# Altium schematic sheet Schema.SchDoc
size A4
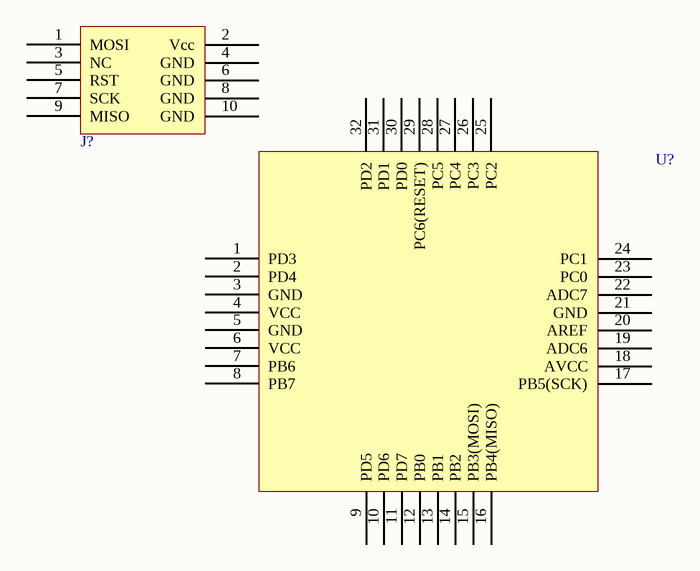
[diagram p0: Schema.SchDoc]

## Parts
J?  61201021721  [Male_10Pin]  (value not drawn)
U?  ATMEGA328P-MU  [QFN50P500X500X100_HS-33N]  (value not drawn)

## Nets

Not connected (* = marked no-connect by the designer): J? 1(MOSI) 2(Vcc) 3(NC) 4 (GND) 5(RST) 6(GND) 7(SCK) 8(GND) 9(MISO) 10(GND); U? 1(PD3) 2(PD4) 3(GND) 4(VCC) 5(GND) 6(VCC) 7(PB6) 8(PB7) 9(PD5) 10(PD6) 11(PD7) 12(PB0) 13(PB1) 14(PB2) 15(PB3(MOSI)) 16(PB4(MISO)) 17(PB5(SCK)) 18(AVCC) 19(ADC6) 20(AREF) 21(GND) 22(ADC7) 23(PC0) 24(PC1) 25(PC2) 26(PC3) 27(PC4) 28(PC5) 29(PC6(RESET)) 30(PD0) 31(PD1) 32(PD2)

## Library data of the parts
J? = 61201021721: CONN HEADER R/A 10POS 2.54MM; Manufacturer: Wurth Electronics; Current Rating: 3A; Voltage Rating: 250V; Number of Positions: 10; Insulation Resistance: 1GR; Gender: Male; Connector Type: Male Pin; Insulation: Insulated; Row Spacing: 0.1inch; Supplier 1: Digi-Key; Manufacturer Part Number: 61201021721; RoHS: Yes; Category: Headers and Wire Housings; Stock 1: 2053; Pricing 1: 1=0,59000, 10=0,58200, 50=0,53800, 100=0,48200, 260=0,43738 (USD); Mount: Through Hole; Contact Plating: Gold; Housing Material: PBT; Contact Material: Copper Alloy,Copper; Color: Black; Min Operating Temperature: -40°C; Max Operating Temperature: 125°C; Number of Rows: 2; Contact Gender: Male; Packaging: Tray; Package Quantity: 260; Termination: Through Hole; Number of Contacts: 10; Orientation: Right Angle; Length: 20.36mm; Height: 8.85mm; Width: 20.36mm; Pitch: 2.54mm; REACH SVHC: Unknown; Flammability Rating: UL94 V-0; ComponentLink1URL: https://datasheet.ciiva.com/731/61201021721-731348.pdf?src-supplier=Digi-Key; ComponentLink1Description: https://datasheet.ciiva.com/731/61201021721-731348.pdf?src-supplier=Digi-Key; ComponentLink2URL: https://datasheet.ciiva.com/13679/6120xx21721-265860-13679056.pdf?src-supplier=Mouser; ComponentLink2Description: https://datasheet.ciiva.com/13679/6120xx21721-265860-13679056.pdf?src-supplier=Mouser; ComponentLink3URL: https://datasheet.ciiva.com/7648/624622-7648122.pdf?src-supplier=Element14; ComponentLink3Description: https://datasheet.ciiva.com/7648/624622-7648122.pdf?src-supplier=Element14; ComponentLink4URL: https://datasheet.ciiva.com/48700/001088159-da-01-en-wr-bhd-wannenstiftleiste-61201021721-48700602.pdf?src-supplier=Conrad; ComponentLink4Description: https://datasheet.ciiva.com/48700/001088159-da-01-en-wr-bhd-wannenstiftleiste-61201021721-48700602.pdf?src-supplier=Conrad; Supplier Part Number 1: 732-2098-ND
U? = ATMEGA328P-MU: MICROCHIP - ATMEGA328P-MU - MCU 8BIT, AVR, 32K FLASH, 32QFN; Interface: I2C,SPI,UART,USART; Peripherals: Brown-out Detect/Reset,POR,PWM,WDT; Frequency: 20MHz; Number of I/Os: 23; Memory Size: 32KB; Oscillator Type: Internal; Supplier 1: Digi-Key; Manufacturer: Microchip; Manufacturer Part Number: ATMEGA328P-MU; RoHS: No; Category: Microcontrollers; Stock 1: 5700; Pricing 1: 1=2,01000, 25=1,84000, 100=1,67000 (USD); Case/Package: VQFN; Min Operating Temperature: -40°C; Max Operating Temperature: 85°C; Memory Type: FLASH; Packaging: Tray; Core Architecture: AVR; ComponentLink1URL: http://www.farnell.com/datasheets/2047852.pdf?src-supplier=Farnell; ComponentLink1Description: http://www.farnell.com/datasheets/2047852.pdf?src-supplier=Farnell; ComponentLink2URL: http://www.microchip.com/mymicrochip/filehandler.aspx?ddocname=en589968&src-supplier=Digi-Key; ComponentLink2Description: http://www.microchip.com/mymicrochip/filehandler.aspx?ddocname=en589968&src-supplier=Digi-Key; ComponentLink3URL: http://www.farnell.com/datasheets/798182.pdf?src-supplier=Newark; ComponentLink3Description: http://www.farnell.com/datasheets/798182.pdf?src-supplier=Newark; ComponentLink4URL: http://www.farnell.com/datasheets/2047852.pdf?src-supplier=Element14; ComponentLink4Description: http://www.farnell.com/datasheets/2047852.pdf?src-supplier=Element14; Supplier Part Number 1: ATMEGA328P-MU-ND